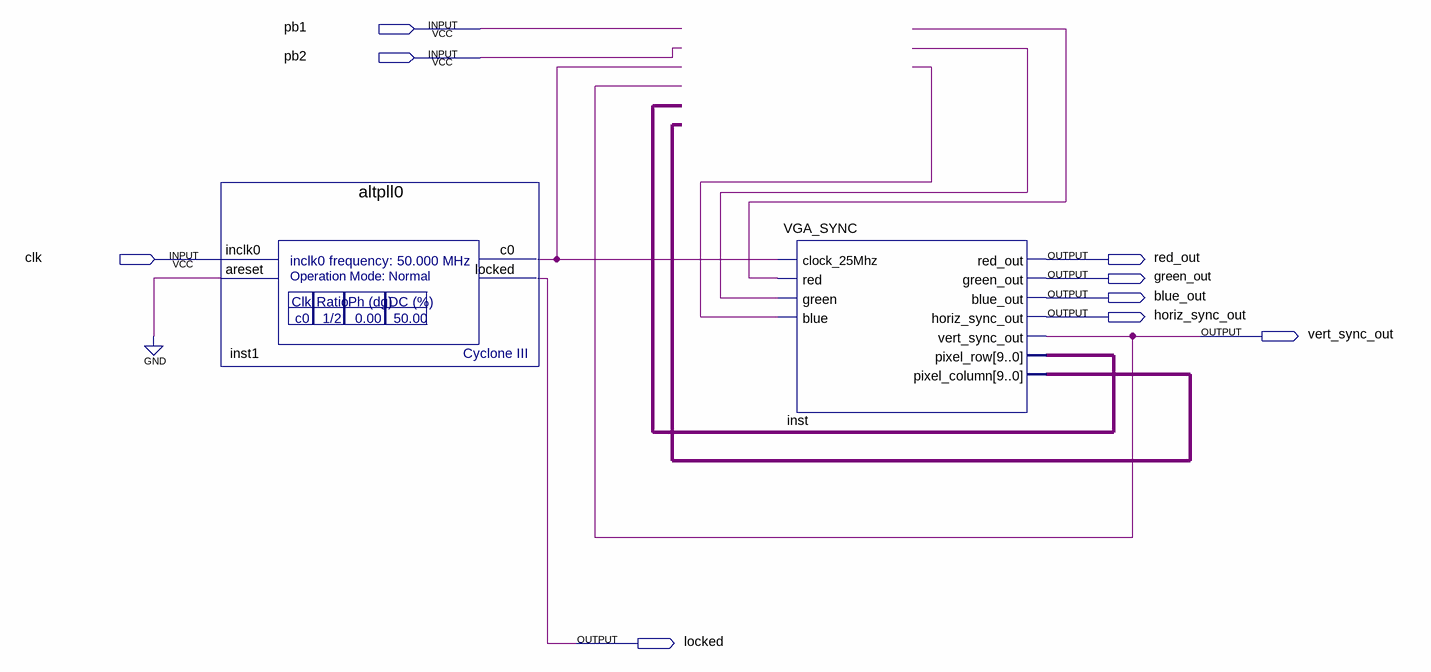
[diagram p0: schematic sheet]
// Quartus schematic pipe.bdf as structural Verilog: 2 symbols, 9 pins
module pipe (
  input  pb1,
  input  pb2,
  input  clk,
  output red_out,
  output green_out,
  output blue_out,
  output horiz_sync_out,
  output vert_sync_out,
  output locked
);

  wire inst1_c0, undriven, undriven_2, undriven_3;
  wire [9:0] inst_pixel_column, inst_pixel_row;

  altpll0 inst1 (.inclk0(clk), .areset(1'b0), .c0(inst1_c0), .locked(locked));
  VGA_SYNC inst (
    .clock_25Mhz(inst1_c0), .red(undriven_2), .green(undriven_3), .blue(undriven), .red_out(red_out),
    .green_out(green_out), .blue_out(blue_out), .horiz_sync_out(horiz_sync_out),
    .vert_sync_out(vert_sync_out), .pixel_row(inst_pixel_row), .pixel_column(inst_pixel_column));
endmodule
